# EAGLE schematic PCB 5.0 _ 2024 v29 (EAGLE 9.7.0)
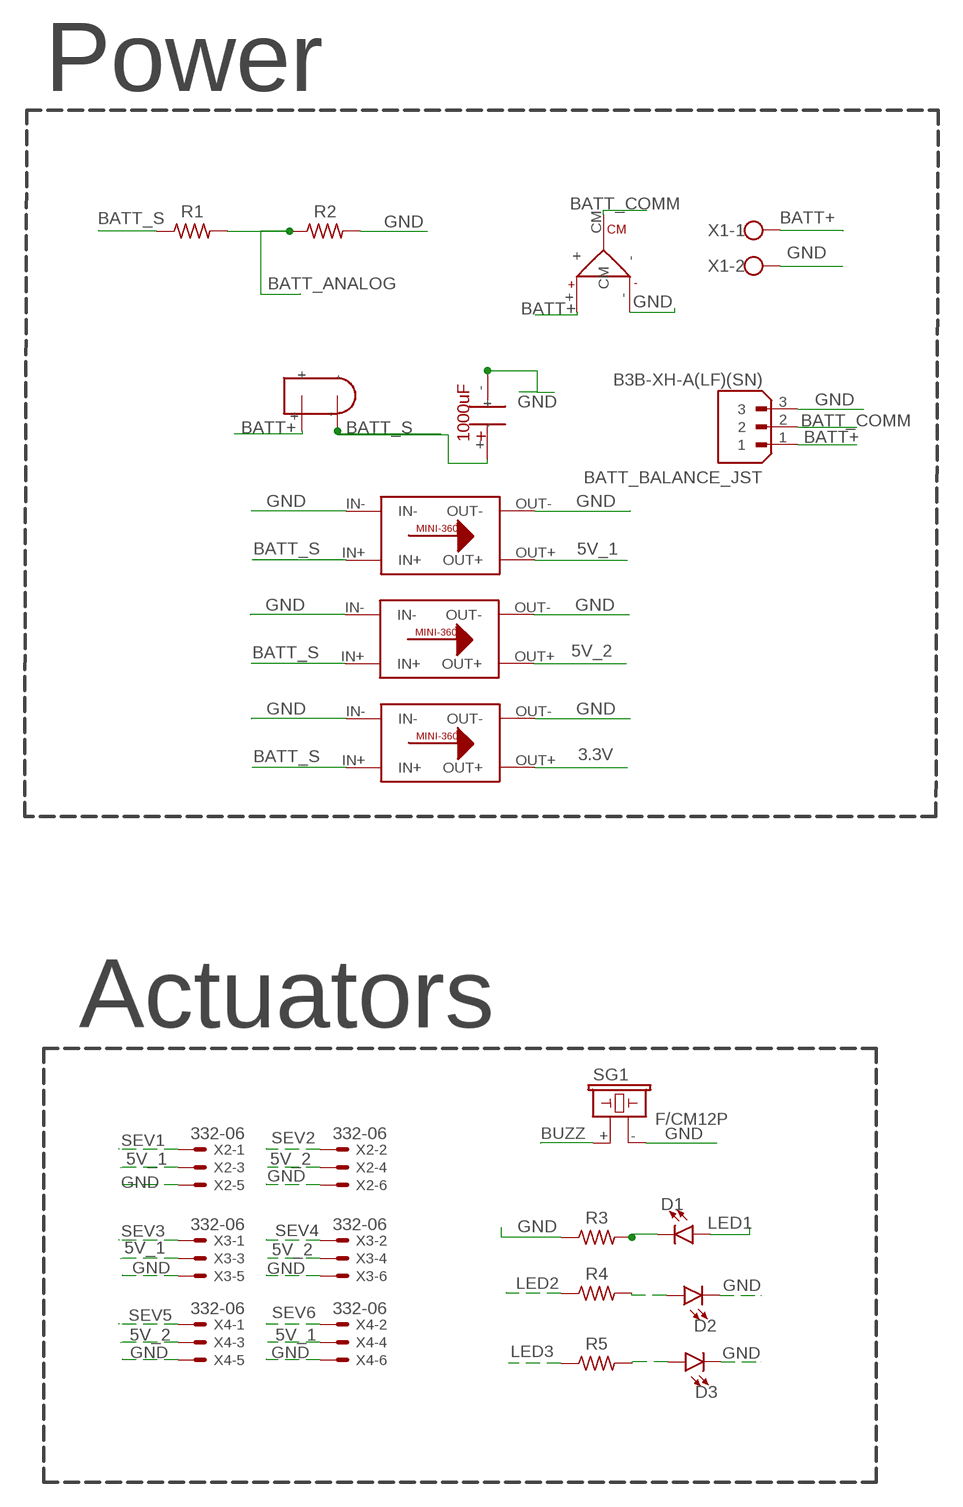
[diagram p0: schematic, sheet 1, part 1 of 2]
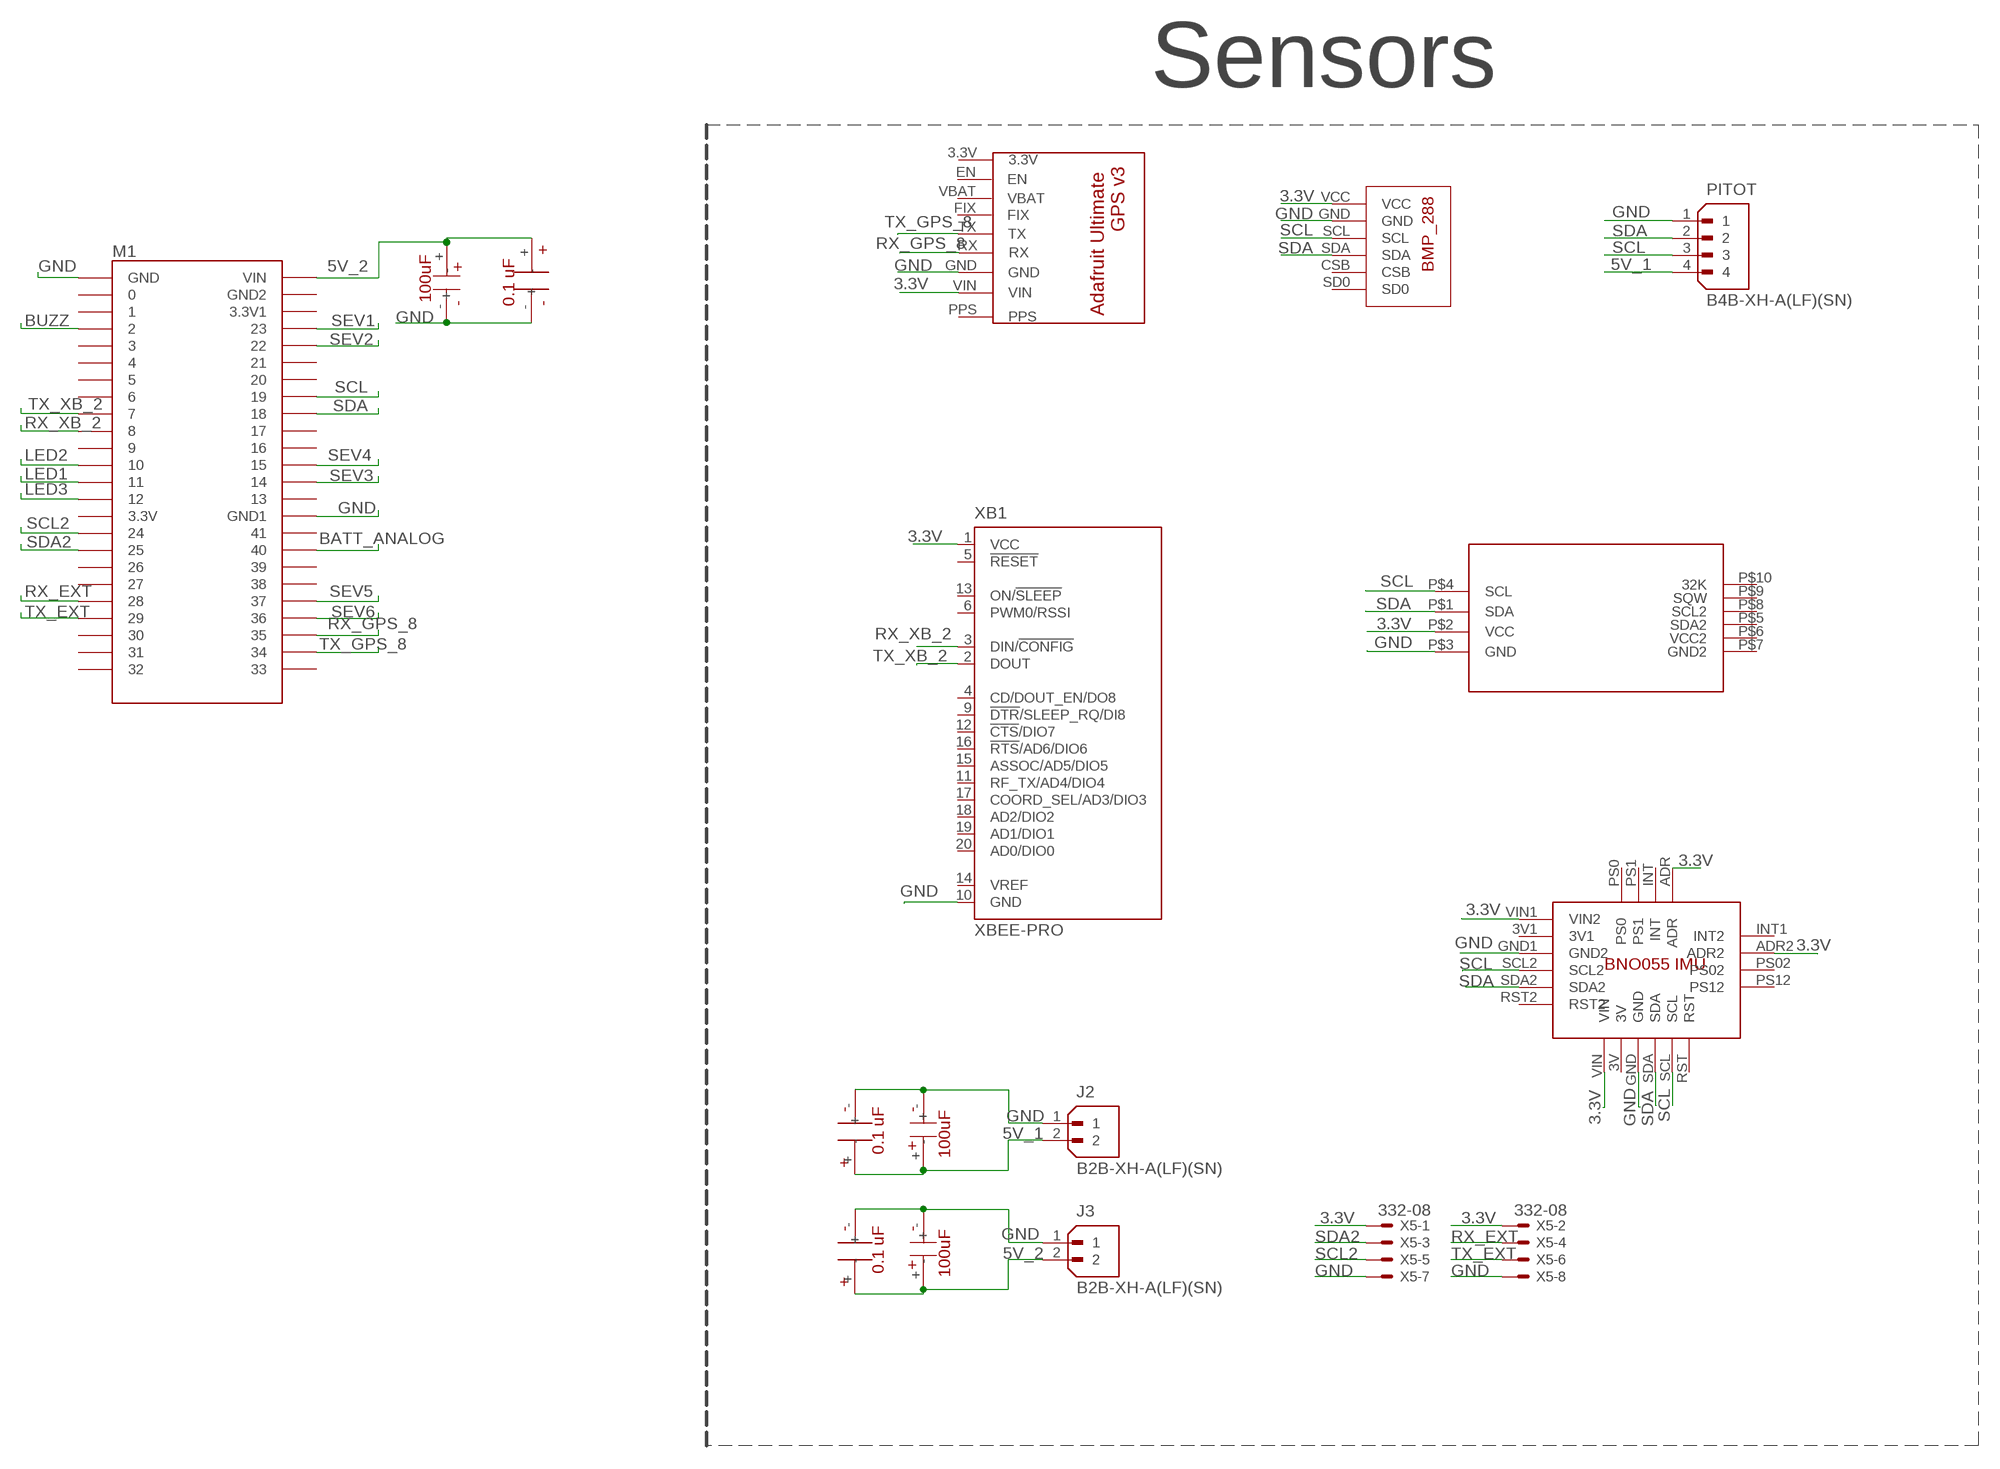
[diagram p1: schematic, sheet 1, part 2 of 2]

## Parts
BATT_BALANCE_JST  B3B-XH-A(LF)(SN)  [JST_B3B-XH-A(LF)(SN)]
BATT_CONNECTOR  MT60_MALE  [MT-60]
D1  LED3MM  [LED_3MM]
D2  LED3MM  [LED_3MM]
D3  LED3MM  [LED_3MM]
J2  B2B-XH-A(LF)(SN)  [JST_B2B-XH-A(LF)(SN)]
J3  B2B-XH-A(LF)(SN)  [JST_B2B-XH-A(LF)(SN)]
M1  TEENSY4.1  [TEENSY4.1]
PITOT  B4B-XH-A(LF)(SN)  [JST_B4B-XH-A(LF)(SN)]
R1  R-US_AXIAL-7.2MM-PITCH  [RESAD724W46L381D178B]
R2  R-US_AXIAL-7.2MM-PITCH  [RESAD724W46L381D178B]
R3  R-US_AXIAL-7.2MM-PITCH  [RESAD724W46L381D178B]
R4  R-US_AXIAL-7.2MM-PITCH  [RESAD724W46L381D178B]
R5  R-US_AXIAL-7.2MM-PITCH  [RESAD724W46L381D178B]
SG1  F/CM12P  [F/CM12P]
SWITCH  XT-30U  [XT-30U]
U$1  1000UF1000UF  [1000UF]
U$2  ULTIMATE_GPS  [ADAFRUIT_ULTIMATE_GPS]
U$3  VARY_BUCKMINI-360  [VARY_BUCK]
U$4  VARY_BUCKMINI-360  [VARY_BUCK]
U$5  VARY_BUCKMINI-360  [VARY_BUCK]
U$6  BMP_280THTOUGHHOLE  [BNO055_SELF]
U$7  DS3231_RTC  [DS3231_RTC]
U$8  BNO055  [BNO055]
U$9  100UF-ELECTROLYTIC  [100UF_ELECTROLYTIC]
U$10  100UF-ELECTROLYTIC  [100UF_ELECTROLYTIC]
U$11  100UF-ELECTROLYTIC  [100UF_ELECTROLYTIC]
U$12  0.1UF_CERAMIC  [0.1UF_CERAMIC]
U$13  0.1UF_CERAMIC  [0.1UF_CERAMIC]
U$14  0.1UF_CERAMIC  [0.1UF_CERAMIC]
X1  W237-102  [W237-102]
X2  332-06  [332-06]
X3  332-06  [332-06]
X4  332-06  [332-06]
X5  332-08  [332-08]
XB1  XBEE-PRO  [XBEE-PRO]

## Nets
3.3V: U$2.VIN U$5.OUT+ U$6.VCC U$7.P$2(VCC) U$8.ADR U$8.ADR2 U$8.VIN U$8.VIN1(VIN2) X5.1 X5.2 XB1.1(VCC)
5V_1: J2.2 PITOT.4 U$3.OUT+ U$9.+ U$14.+ X2.3 X3.3 X4.4
5V_2: J3.2 M1.VIN U$4.OUT+ U$10.+ U$11.+ U$12.+ U$13.+ X2.4 X3.4 X4.3
BATT+: BATT_BALANCE_JST.1 BATT_CONNECTOR.+ SWITCH.+ X1.1
BATT_ANALOG: M1.40 R1.2 R2.1
BATT_COMM: BATT_BALANCE_JST.2 BATT_CONNECTOR.CM
BATT_S: R1.1 SWITCH.- U$1.+ U$3.IN+ U$4.IN+ U$5.IN+
BUZZ: M1.2 SG1.+
GND: BATT_BALANCE_JST.3 BATT_CONNECTOR.- D2.K(C) D3.K(C) J2.1 J3.1 M1.GND M1.GND1 PITOT.1 R2.2 R3.1 SG1.- U$1.- U$2.GND U$3.IN- U$3.OUT- U$4.IN- U$4.OUT- U$5.IN- U$5.OUT- U$6.GND U$7.P$3(GND) U$8.GND U$8.GND1(GND2) U$9.- U$10.- U$11.- U$12.- U$13.- U$14.- X1.2 X2.5 X2.6 X3.5 X3.6 X4.5 X4.6 X5.7 X5.8 XB1.10(GND)
LED1: D1.A M1.11/MOSI
LED2: M1.10/CS R4.1
LED3: M1.12/MISO R5.1
N$1: D1.K(C) R3.2
N$2: D2.A R4.2
N$3: D3.A R5.2
RX_EXT: M1.28 X5.4
RX_GPS_8: M1.35 U$2.RX
RX_XB_2: M1.8 XB1.3(DIN/!CONFIG)
SCL: M1.19/A5/SCL PITOT.3 U$6.SCL U$7.P$4(SCL) U$8.SCL U$8.SCL2
SCL2: M1.24 X5.5
SDA: M1.18/A4/SDA PITOT.2 U$6.SDA U$7.P$1(SDA) U$8.SDA U$8.SDA2
SDA2: M1.25 X5.3
SEV1: M1.23/A9 X2.1
SEV2: M1.22/A8 X2.2
SEV3: M1.14/A0 X3.1
SEV4: M1.15/A1 X3.2
SEV5: M1.37 X4.1
SEV6: M1.36 X4.2
TX_EXT: M1.29 X5.6
TX_GPS_8: M1.34 U$2.TX
TX_XB_2: M1.7 XB1.2(DOUT)
Unconnected: M1.0/RX M1.1/TX M1.3 M1.3V3(3.3V) M1.3V3_LO(3.3V1) M1.4 M1.5 M1.6 M1.9 M1.13/SCK M1.16/A2 M1.17/A3 M1.20/A6 M1.21/A7 M1.26 M1.27 M1.30 M1.31/A12 M1.32 M1.33 M1.38 M1.39 M1.41 M1.AGND(GND2) U$2.3.3V U$2.EN U$2.FIX U$2.PPS U$2.VBAT U$6.CSB U$6.SD0 U$7.P$5(SDA2) U$7.P$6(VCC2) U$7.P$7(GND2) U$7.P$8(SCL2) U$7.P$9(SQW) U$7.P$10(32K) U$8.3V U$8.3V1 U$8.INT U$8.INT1(INT2) U$8.PS0 U$8.PS1 U$8.PS02 U$8.PS12 U$8.RST U$8.RST2 XB1.4(CD/DOUT_EN/DO8) XB1.5(!RESET) XB1.6(PWM0/RSSI) XB1.9(!DTR!/SLEEP_RQ/DI8) XB1.11(RF_TX/AD4/DIO4) XB1.12(!CTS!/DIO7) XB1.13(ON/!SLEEP) XB1.14(VREF) XB1.15(ASSOC/AD5/DIO5) XB1.16(!RTS!/AD6/DIO6) XB1.17(COORD_SEL/AD3/DIO3) XB1.18(AD2/DIO2) XB1.19(AD1/DIO1) XB1.20(AD0/DIO0)

## Notes on the sheet
- Power
- Sensors
- Actuators

## Library data of the parts
BATT_BALANCE_JST = JST_3Pin:B3B-XH-A(LF)(SN): Check availability <https://pricing.snapeda.com/parts/B3B-XH-A%28LF%29%28SN%29/JST%20Sales/view-part?ref=eda>; AVAILABILITY: In Stock; CHECK_PRICES: https://www.snapeda.com/parts/B3B-XH-A(LF)(SN)/JST+Sales+America+Inc./view-part/?ref=eda; DESCRIPTION: Connector Header Through Hole 3 position 0.098 (2.50mm); MF: JST Sales; MP: B3B-XH-A(LF)(SN); PACKAGE: None; PRICE: None; SNAPEDA_LINK: https://www.snapeda.com/parts/B3B-XH-A(LF)(SN)/JST+Sales+America+Inc./view-part/?ref=snap
BATT_CONNECTOR = MT-60:MT60_MALE
D1-D3 = LED:LED: LED (Generic) Standard schematic elements and footprints for 5mm, 3mm, 1206, and 0603 sized LEDs. Generic LEDs with no color specified.; PROD_ID: DIO-08794
J2 J3 = JST_2Pin:B2B-XH-A(LF)(SN): Check availability <https://pricing.snapeda.com/parts/B2B-XH-A%28LF%29%28SN%29/JST%20Sales/view-part?ref=eda>; AVAILABILITY: In Stock; CHECK_PRICES: https://www.snapeda.com/parts/B2B-XH-A(LF)(SN)/JST+Sales+America+Inc./view-part/?ref=eda; DESCRIPTION: Connector Header Through Hole 2 position 0.098 (2.50mm); MF: JST Sales; MP: B2B-XH-A(LF)(SN); PACKAGE: None; PRICE: None; SNAPEDA_LINK: https://www.snapeda.com/parts/B2B-XH-A(LF)(SN)/JST+Sales+America+Inc./view-part/?ref=snap
M1 = Teensy4.1_Main_Pins:TEENSY4.1
PITOT = JST_4Pin:B4B-XH-A(LF)(SN); CHECK_PRICES: https://www.snapeda.com/parts/B4B-XH-A(LF)(SN)/JST+Sales+America+Inc./view-part/?ref=eda; DESCRIPTION: Connector Header Through Hole 4 position 0.098 (2.50mm); MF: JST Sales; MP: B4B-XH-A(LF)(SN); PACKAGE: None; SNAPEDA_LINK: https://www.snapeda.com/parts/B4B-XH-A(LF)(SN)/JST+Sales+America+Inc./view-part/?ref=snap
R1-R5 = Resistor:R-US: Resistor Fixed - ANSI; CATEGORY: Resistor; SUB-CATEGORY: Fixed
SG1 = buzzer_roundHole:F/CM12P: BUZZER Source: Buerklin; OC_FARNELL: unknown; OC_NEWARK: unknown
SWITCH = XT-30U_M:XT-30U
U$1 = 1000uF:1000UF
U$2 = Adafruit_Ultimate_GPS:ULTIMATE_GPS
U$3-U$5 = MINI-360:VARY_BUCK
U$6 = BMP280:BMP_280
U$7 = RTC_DS3231:DS3231_RTC
U$8 = Library:BNO055
U$9-U$11 = 100uF:100UF-ELECTROLYTIC
U$12-U$14 = 0.1uF:0.1UF_CERAMIC
X1 = ScrewTerminal:W237-102: WAGO SCREW CLAMP; MPN: 237-102; OC_FARNELL: unknown; OC_NEWARK: 70K9898
X2-X4 = 6pinConnector:332-06: 6 Pin - 2mm Dual Row Source: www.mpe-connector.de / garry_shortform_2012.pdf
X5 = 6pinConnector:332-08: 8 Pin - 2mm Dual Row Source: www.mpe-connector.de / garry_shortform_2012.pdf
XB1 = Xbee:XBEE: XBee (TM) /XBee-PRO(TM) OEM RF Modules Source: MaxStream, Inc. xbee_productmanual.pdf; MPN: XBP24-AWI-001; OC_FARNELL: 1337916; OC_NEWARK: 42M2667